# EAGLE schematic USB-PD-PSU (EAGLE 9.2.1)

## Sheet 1 of 3: USB-PD
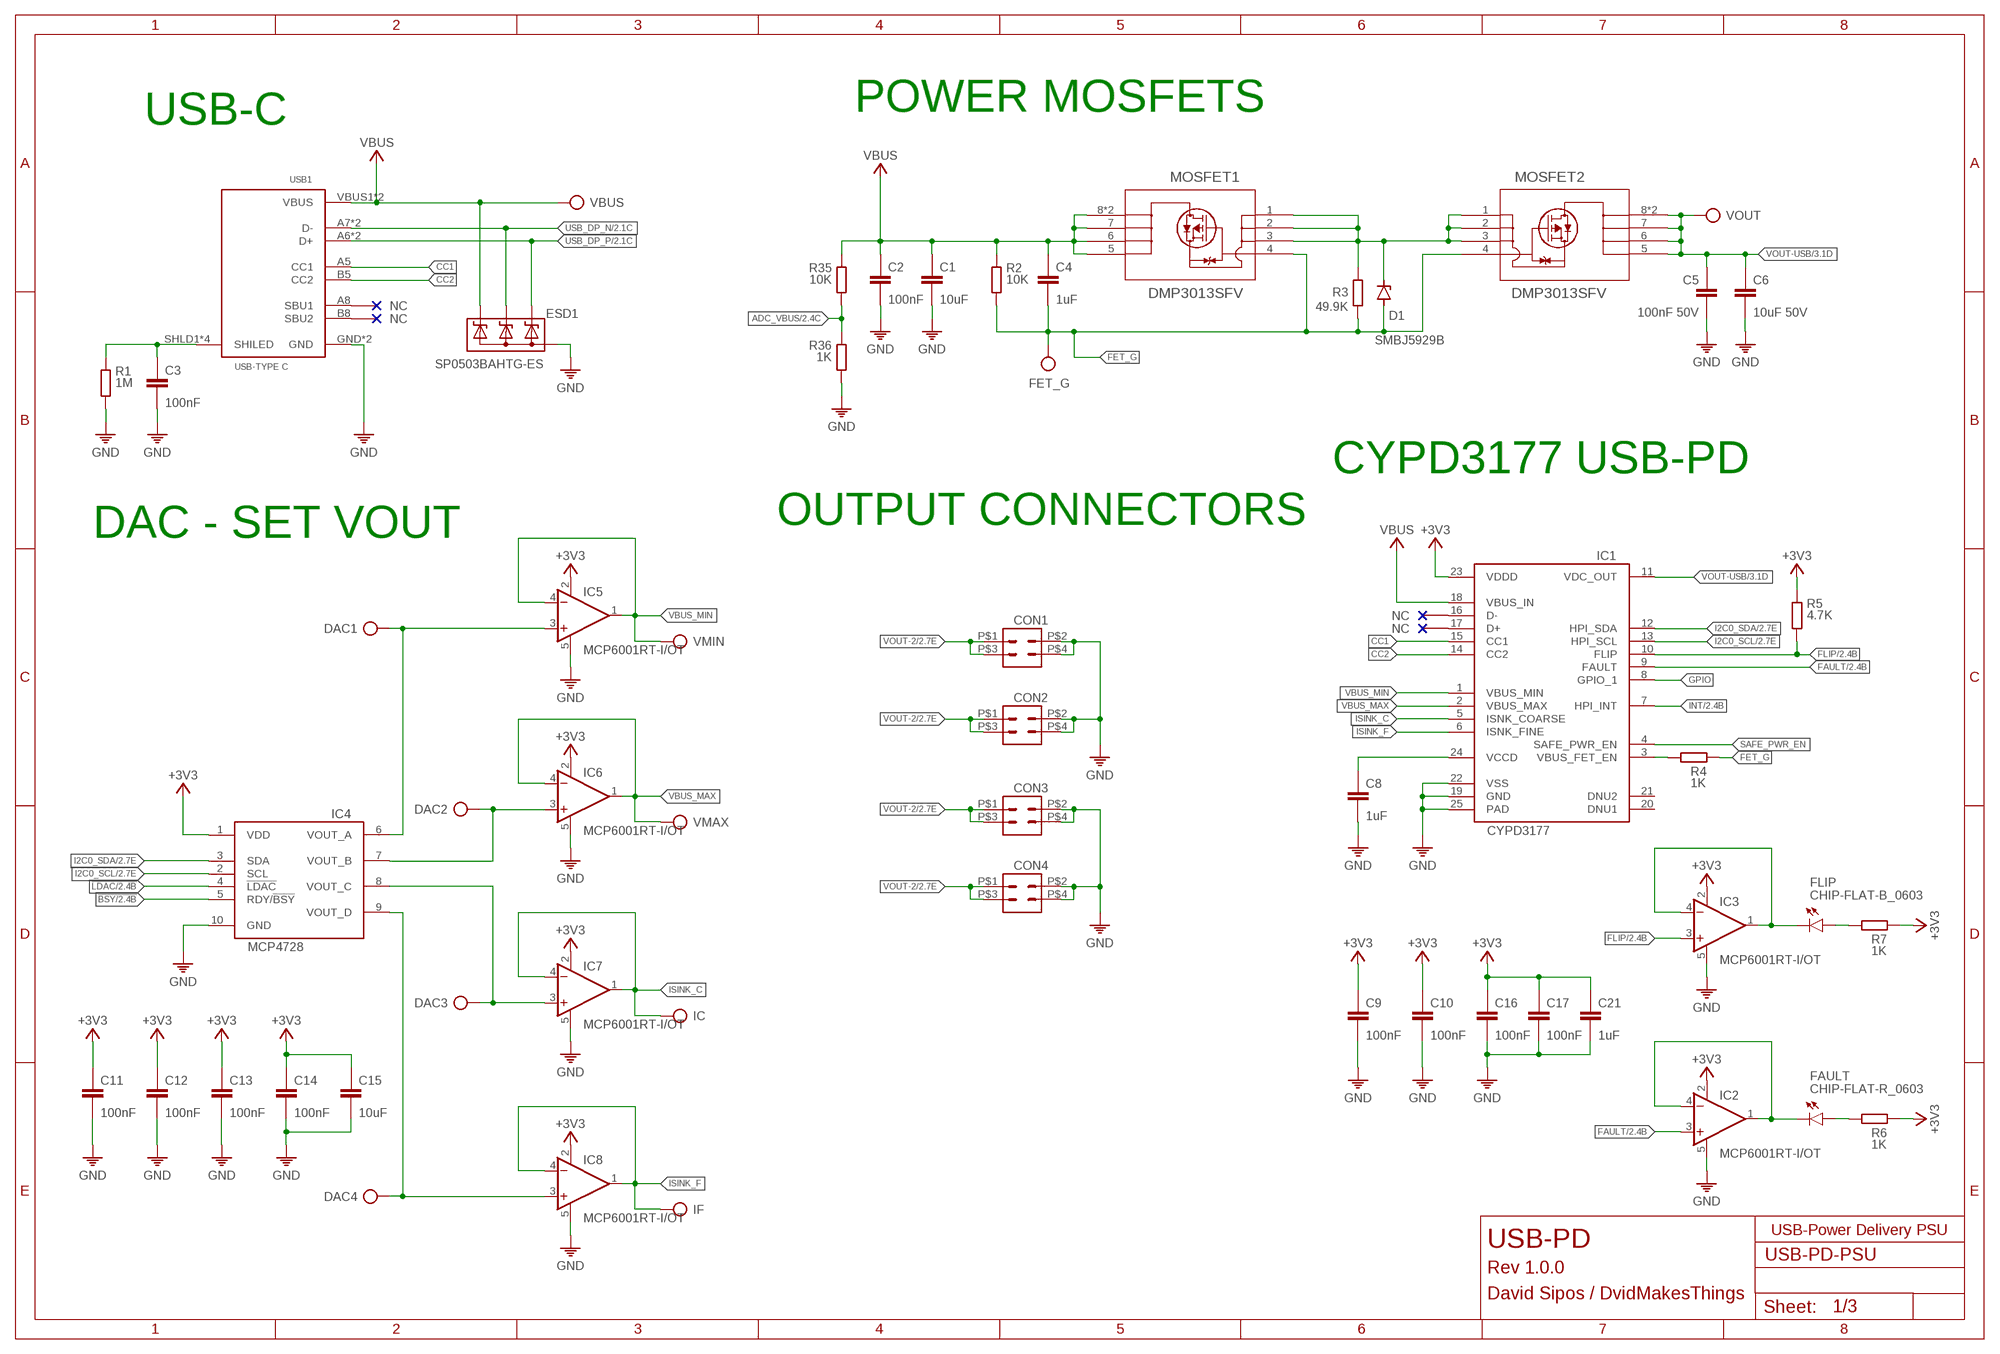
[diagram p0: schematic, sheet 1]

### Parts
C1  10uF  C-0805  [C0805]
C2  100nF  C-0603  [C0603]
C3  100nF  C-0603  [C0603]
C4  1uF  C-0603  [C0603]
C5  100nF 50V  C-0603  [C0603]
C6  10uF 50V  C-0603  [C0603]
C8  1uF  C-0201  [0201]
C9  100nF  C-0201  [0201]
C10  100nF  C-0201  [0201]
C11  100nF  C-0201  [0201]
C12  100nF  C-0201  [0201]
C13  100nF  C-0201  [0201]
C14  100nF  C-0201  [0201]
C15  10uF  C-0201  [0201]
C16  100nF  C-0201  [0201]
C17  100nF  C-0201  [0201]
C21  1uF  C-0201  [0201]
CON1  CON-2X2SMD  [2X2_SMD]
CON2  CON-2X2SMD  [2X2_SMD]
CON3  CON-2X2SMD  [2X2_SMD]
CON4  CON-2X2SMD  [2X2_SMD]
D1  SMBJ5929B  ZENERDO-214AC(SMA)  [DIOM5226X290N]
DAC1  TP  [TP]
DAC2  TP  [TP]
DAC3  TP  [TP]
DAC4  TP  [TP]
ESD1  SP0503BAHTG-ES  SP0503BAHT  [SOT143]
FAULT  CHIP-FLAT-R_0603  CHIP-FLAT-R_0603-0.55MM  [LEDC1608X55N_FLAT-R]
FET_G  TP  [TP]
FLIP  CHIP-FLAT-B_0603  CHIP-FLAT-B_0603-0.55MM  [LEDC1608X55N_FLAT-B]
IC  TP  [TP]
IC1  CYPD3177  CYPD3177-24LQXQT  [QFN24]
IC2  MCP6001RT-I/OT  MCP6001RT  [SOT23-5]
IC3  MCP6001RT-I/OT  MCP6001RT  [SOT23-5]
IC4  MCP4728  [MSOP10]
IC5  MCP6001RT-I/OT  MCP6001RT  [SOT23-5]
IC6  MCP6001RT-I/OT  MCP6001RT  [SOT23-5]
IC7  MCP6001RT-I/OT  MCP6001RT  [SOT23-5]
IC8  MCP6001RT-I/OT  MCP6001RT  [SOT23-5]
IF  TP  [TP]
MOSFET1  DMP3013SFV  DMP3013SFV-7POWERDI3333-8_UX_DIO  [POWERDI3333-8_UX_DIO-L]
MOSFET2  DMP3013SFV  DMP3013SFV-7POWERDI3333-8_UX_DIO  [POWERDI3333-8_UX_DIO-L]
R1  1M  R0402  [0402]
R2  10K  R0402  [0402]
R3  49.9K  R0402  [0402]
R4  1K  R0201  [R0201]
R5  4.7K  R0201  [R0201]
R6  1K  R0201  [R0201]
R7  1K  R0201  [R0201]
R35  10K  R0402  [0402]
R36  1K  R0402  [0402]
USB1  USB_C-THT  [USB-C]
VBUS  TP  [TP]
VMAX  TP  [TP]
VMIN  TP  [TP]
VOUT  TP  [TP]

### Nets
!BSY: IC4.5(RDY/!BSY) ; also sheet 2
!LDAC: IC4.4(!LDAC) ; also sheet 2
+3V3: C9.1 C10.1 C11.1 C12.1 C13.1 C14.1 C15.1 C16.1 C17.1 C21.1 IC1.23(VDDD) IC2.2(V+) IC3.2(V+) IC4.1(VDD) IC5.2(V+) IC6.2(V+) IC7.2(V+) IC8.2(V+) R5.1 R6.1 R7.1 ; also sheet 2,3
ADC_VBUS: R35.2 R36.1 ; also sheet 2
CC1: IC1.15(CC1) USB1.A5(CC1)
CC2: IC1.14(CC2) USB1.B5(CC2)
FAULT: IC1.9(FAULT) IC2.3(+IN) ; also sheet 2
FET_G: C4.2 D1.2(A) FET_G.TP MOSFET1.4(G) MOSFET2.4(G) R2.2 R3.2 R4.1
FLIP: IC1.10(FLIP) IC3.3(+IN) R5.2 ; also sheet 2
GND: C1.2 C2.2 C3.2 C5.2 C6.2 C8.2 C9.2 C10.2 C11.2 C12.2 C13.2 C14.2 C15.2 C16.2 C17.2 C21.2 CON1.P$2 CON1.P$4 CON2.P$2 CON2.P$4 CON3.P$2 CON3.P$4 CON4.P$2 CON4.P$4 ESD1.1(A) IC1.19(GND) IC1.22(VSS) IC1.25(PAD) IC2.5(V-) IC3.5(V-) IC4.10(GND) IC5.5(V-) IC6.5(V-) IC7.5(V-) IC8.5(V-) R1.2 R36.2 USB1.GND USB1.GND2(GND) ; also sheet 2,3
GPIO: IC1.8(GPIO_1)
I2C0_SCL: IC1.13(HPI_SCL) IC4.2(SCL) ; also sheet 2
I2C0_SDA: IC1.12(HPI_SDA) IC4.3(SDA) ; also sheet 2
INT: IC1.7(HPI_INT) ; also sheet 2
ISINK_C: IC1.5(ISNK_COARSE) IC7.1(OUT) IC7.4(-IN) IC.TP
ISINK_F: IC1.6(ISNK_FINE) IC8.1(OUT) IC8.4(-IN) IF.TP
N$1: C3.1 R1.1 USB1.SHLD1(SHILED) USB1.SHLD2(SHILED) USB1.SHLD3(SHILED) USB1.SHLD4(SHILED)
N$2: FLIP.C IC3.1(OUT) IC3.4(-IN)
N$3: C8.1 IC1.24(VCCD)
N$4: IC1.3(VBUS_FET_EN) R4.2
N$5: D1.1(C) MOSFET1.1(S_2) MOSFET1.2(S_3) MOSFET1.3(S) MOSFET2.1(S_2) MOSFET2.2(S_3) MOSFET2.3(S) R3.1
N$6: FAULT.C IC2.1(OUT) IC2.4(-IN)
N$7: FLIP.A R7.2
N$8: FAULT.A R6.2
N$13: DAC1.TP IC4.6(VOUT_A) IC5.3(+IN)
N$14: DAC2.TP IC4.7(VOUT_B) IC6.3(+IN)
N$15: DAC3.TP IC4.8(VOUT_C) IC7.3(+IN)
N$16: DAC4.TP IC4.9(VOUT_D) IC8.3(+IN)
SAFE_PWR_EN: IC1.4(SAFE_PWR_EN)
USB_DP_N [90R_DIFFPAIR]: ESD1.3(C2) USB1.A7(D-) USB1.B7(D-) ; also sheet 2
USB_DP_P [90R_DIFFPAIR]: ESD1.2(C1) USB1.A6(D+) USB1.B6(D+) ; also sheet 2
VBUS: C1.1 C2.1 C4.1 ESD1.4(C3) IC1.18(VBUS_IN) MOSFET1.5(D_2) MOSFET1.6(D_3) MOSFET1.7(D_4) MOSFET1.8(D) MOSFET1.9(D) R2.1 R35.1 USB1.VBUS1(VBUS) USB1.VBUS2(VBUS) VBUS.TP ; also sheet 2,3
VBUS_MAX: IC1.2(VBUS_MAX) IC6.1(OUT) IC6.4(-IN) VMAX.TP
VBUS_MIN: IC1.1(VBUS_MIN) IC5.1(OUT) IC5.4(-IN) VMIN.TP
VOUT-2: CON1.P$1 CON1.P$3 CON2.P$1 CON2.P$3 CON3.P$1 CON3.P$3 CON4.P$1 CON4.P$3 ; also sheet 2,3
VOUT-USB: C5.1 C6.1 IC1.11(VDC_OUT) MOSFET2.5(D_2) MOSFET2.6(D_3) MOSFET2.7(D_4) MOSFET2.8(D) MOSFET2.9(D) VOUT.TP ; also sheet 3
Unconnected: IC1.16(D-) IC1.17(D+) IC1.20(DNU1) IC1.21(DNU2) USB1.A8(SBU1) USB1.B8(SBU2)

### Notes on the sheet
- USB-C | POWER MOSFETS
- CYPD3177 USB-PD
- DAC - SET VOUT | OUTPUT CONNECTORS
- USB-Power Delivery PSU
- USB-PD
- Rev 1.0.0
- David Sipos / DvidMakesThings

## Sheet 2 of 3: MCU
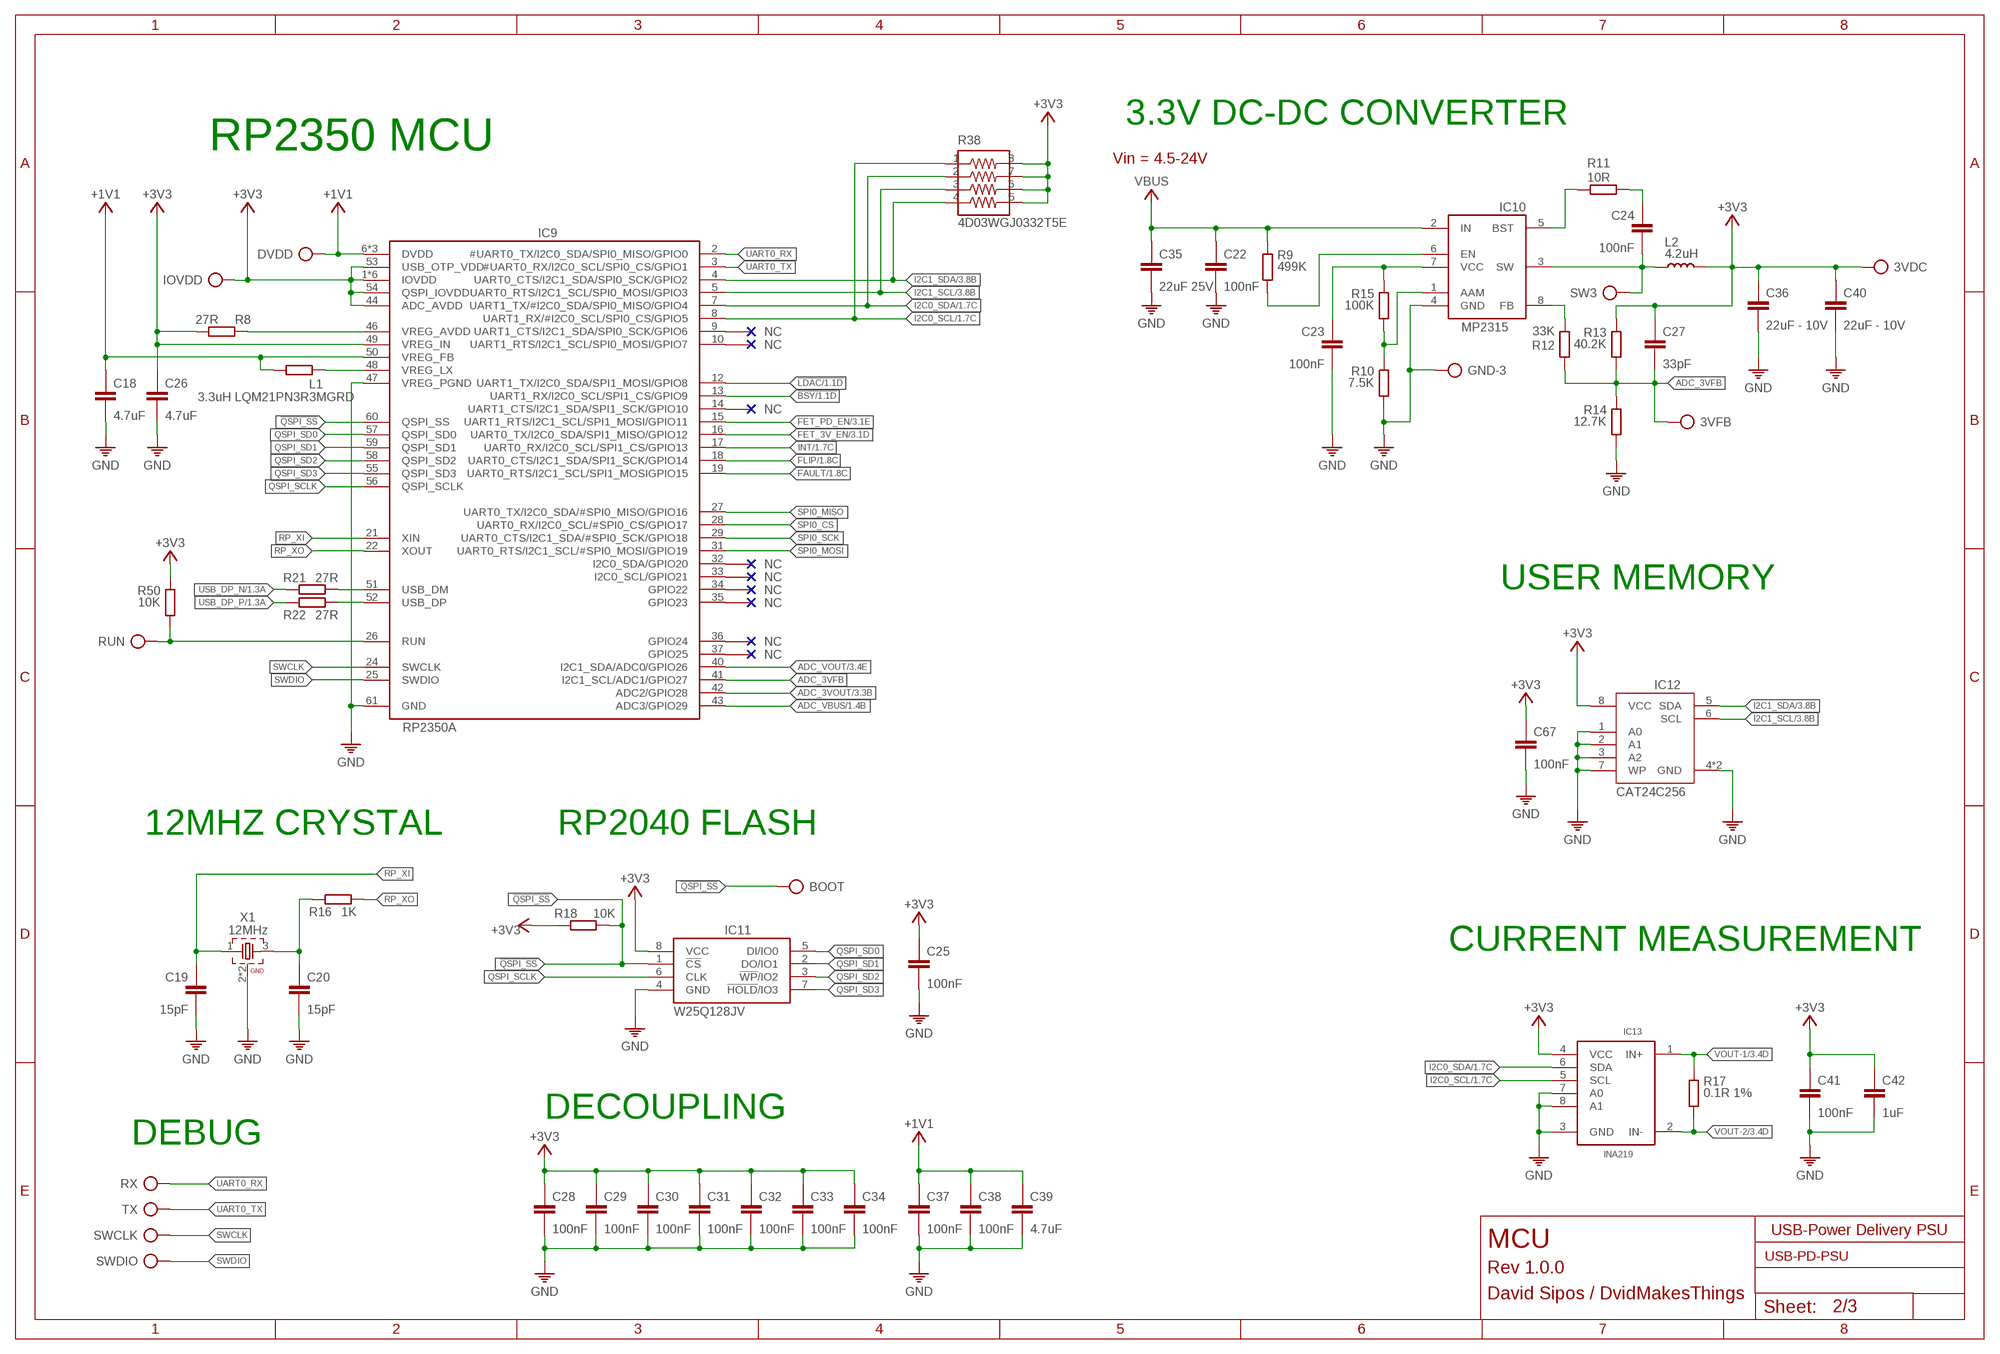
[diagram p1: schematic, sheet 2]

### Parts
3VDC  TP  [TP]
3VFB  TP  [TP]
BOOT  TP  [TP]
C18  4.7uF  C-0201  [0201]
C19  15pF  C-0402  [C0402]
C20  15pF  C-0402  [C0402]
C22  100nF  C0402  [0402]
C23  100nF  C0402  [0402]
C24  100nF  C0402  [0402]
C25  100nF  C-0402  [C0402]
C26  4.7uF  C-0201  [0201]
C27  33pF  C0402  [0402]
C28  100nF  C-0201  [0201]
C29  100nF  C-0201  [0201]
C30  100nF  C-0201  [0201]
C31  100nF  C-0201  [0201]
C32  100nF  C-0201  [0201]
C33  100nF  C-0201  [0201]
C34  100nF  C-0201  [0201]
C35  22uF 25V  C-1206  [C1206]
C36  22uF - 10V  C-1206  [C1206]
C37  100nF  C-0201  [0201]
C38  100nF  C-0201  [0201]
C39  4.7uF  C-0201  [0201]
C40  22uF - 10V  C-1206  [C1206]
C41  100nF  C-0201  [0201]
C42  1uF  C-0201  [0201]
C67  100nF  C-0201  [0201]
DVDD  TP  [TP]
GND-3  TP  [TP]
IC9  RP2350AA  [QFN40P700X700X85-61T340N]
IC10  MP2315S  MP2315TSOT23-8  [SOT65P280X110-8N]
IC11  W25Q128JVPIQ  W25Q128JVP  [SON127P600X500X75-8N]
IC12  CAT24C512HU5IGT3  CAT24C256-HU4  [SON50P300X200X50-9T130X140N]
IC13  INA219BIDCNT  [SOT23-8]
IOVDD  TP  [TP]
L1  3.3uH LQM21PN3R3MGRD  R0805  [0805]
L2  4.2uH  L  [SRR5228A]
R8  27R  R0201  [R0201]
R9  499K  R0402  [0402]
R10  7.5K  R0402  [0402]
R11  10R  R0402  [0402]
R12  33K  R0402  [0402]
R13  40.2K  R0402  [0402]
R14  12.7K  R0402  [0402]
R15  100K  R0402  [0402]
R16  1K  R0201  [R0201]
R17  0.1R 1%  R2512  [2512]
R18  10K  R0402  [0402]
R21  27R  R0201  [R0201]
R22  27R  R0201  [R0201]
R38  4D03WGJ0332T5E  742C083103JP  [742C083103JP]
R50  10K  R0402  [0402]
RUN  TP  [TP]
RX  TP  [TP]
SW3  TP  [TP]
SWCLK  TP  [TP]
SWDIO  TP  [TP]
TX  TP  [TP]
X1  12MHz  WE-XTAL_CFPX-180_830055295  [WE-XTAL_CFPX-180]

### Nets
!BSY: IC9.13(UART1_RX/I2C0_SCL/SPI1_CS/GPIO9) ; also sheet 1
!LDAC: IC9.12(UART1_TX/I2C0_SDA/SPI1_MOSI/GPIO8) ; also sheet 1
!QSPI_SS: BOOT.TP IC9.60(QSPI_SS) IC11.1(!CS) R18.1
+1V1: C18.1 C37.1 C38.1 C39.1 DVDD.TP IC9.6(DVDD) IC9.23(DVDD) IC9.39(DVDD) IC9.50(VREG_FB) L1.2
+3V3: 3VDC.TP C25.1 C26.1 C27.1 C28.1 C29.1 C30.1 C31.1 C32.1 C33.1 C34.1 C36.1 C40.1 C41.1 C42.1 C67.1 IC9.1(IOVDD) IC9.11(IOVDD) IC9.20(IOVDD) IC9.30(IOVDD) IC9.38(IOVDD) IC9.44(ADC_AVDD) IC9.45(IOVDD) IC9.49(VREG_IN) IC9.53(USB_OTP_VDD) IC9.54(QSPI_IOVDD) IC11.8(VCC) IC12.8(VCC) IC13.4(VCC) IOVDD.TP L2.2 R8.2 R13.1 R18.2 R38.5 R38.6 R38.7 R38.8 R50.1 ; also sheet 1,3
ADC_3VFB: 3VFB.TP C27.2 IC9.41(I2C1_SCL/ADC1/GPIO27) R12.2 R13.2 R14.1
ADC_3VOUT: IC9.42(ADC2/GPIO28) ; also sheet 3
ADC_VBUS: IC9.43(ADC3/GPIO29) ; also sheet 1
ADC_VOUT: IC9.40(I2C1_SDA/ADC0/GPIO26) ; also sheet 3
FAULT: IC9.19(UART0_RTS/I2C1_SCL/SPI1_MOSIGPIO15) ; also sheet 1
FET_3V_EN: IC9.16(UART0_TX/I2C0_SDA/SPI1_MISO/GPIO12) ; also sheet 3
FET_PD_EN: IC9.15(UART1_RTS/I2C1_SCL/SPI1_MOSI/GPIO11) ; also sheet 3
FLIP: IC9.18(UART0_CTS/I2C1_SDA/SPI1_SCK/GPIO14) ; also sheet 1
GND: C18.2 C19.2 C20.2 C22.2 C23.2 C25.2 C26.2 C28.2 C29.2 C30.2 C31.2 C32.2 C33.2 C34.2 C35.2 C36.2 C37.2 C38.2 C39.2 C40.2 C41.2 C42.2 C67.2 GND-3.TP IC9.47(VREG_PGND) IC9.61(GND) IC10.4(GND) IC11.4(GND) IC12.1(A0) IC12.2(A1) IC12.3(A2) IC12.4(GND) IC12.7(WP) IC12.9(GND) IC13.3(GND) IC13.7(A0) IC13.8(A1) R10.2 R14.2 X1.2(GND) X1.4(GND) ; also sheet 1,3
I2C0_SCL: IC9.8(UART1_RX/#I2C0_SCL/SPI0_CS/GPIO5) IC13.5(SCL) R38.1 ; also sheet 1
I2C0_SDA: IC9.7(UART1_TX/#I2C0_SDA/SPI0_MISO/GPIO4) IC13.6(SDA) R38.2 ; also sheet 1
I2C1_SCL: IC9.5(UART0_RTS/I2C1_SCL/SPI0_MOSI/GPIO3) IC12.6(SCL) R38.3 ; also sheet 3
I2C1_SDA: IC9.4(UART0_CTS/I2C1_SDA/SPI0_SCK/GPIO2) IC12.5(SDA) R38.4 ; also sheet 3
INT: IC9.17(UART0_RX/I2C0_SCL/SPI1_CS/GPIO13) ; also sheet 1
MCU_DP_N [90R_DIFFPAIR]: IC9.51(USB_DM) R21.2
MCU_DP_P [90R_DIFFPAIR]: IC9.52(USB_DP) R22.2
N$9: C20.1 R16.1 X1.3
N$10: IC9.46(VREG_AVDD) R8.1
N$11: IC9.48(VREG_LX) L1.1
N$17: IC9.26(RUN) R50.2 RUN.TP
N$38: IC10.5(BST) R11.2
N$39: IC10.8(FB) R12.1
N$41: C24.1 R11.1
N$43: IC10.6(EN) R9.2
N$44: C23.1 IC10.7(VCC) R15.1
N$46: IC10.1(AAM) R10.1 R15.2
QSPI_SCLK: IC9.56(QSPI_SCLK) IC11.6(CLK)
QSPI_SD0: IC9.57(QSPI_SD0) IC11.5(DI/IO0)
QSPI_SD1: IC9.59(QSPI_SD1) IC11.2(DO/IO1)
QSPI_SD2: IC9.58(QSPI_SD2) IC11.3(!WP!/IO2)
QSPI_SD3: IC9.55(QSPI_SD3) IC11.7(!HOLD!/IO3)
RP_XI: C19.1 IC9.21(XIN) X1.1
RP_XO: IC9.22(XOUT) R16.2
SPI0_CS: IC9.28(UART0_RX/I2C0_SCL/#SPI0_CS/GPIO17)
SPI0_MISO: IC9.27(UART0_TX/I2C0_SDA/#SPI0_MISO/GPIO16)
SPI0_MOSI: IC9.31(UART0_RTS/I2C1_SCL/#SPI0_MOSI/GPIO19)
SPI0_SCK: IC9.29(UART0_CTS/I2C1_SDA/#SPI0_SCK/GPIO18)
SW3: C24.2 IC10.3(SW) L2.1 SW3.TP
SWCLK: IC9.24(SWCLK) SWCLK.TP
SWDIO: IC9.25(SWDIO) SWDIO.TP
UART0_RX: IC9.2(#UART0_TX/I2C0_SDA/SPI0_MISO/GPIO0) RX.TP
UART0_TX: IC9.3(#UART0_RX/I2C0_SCL/SPI0_CS/GPIO1) TX.TP
USB_DP_N [90R_DIFFPAIR]: R21.1 ; also sheet 1
USB_DP_P [90R_DIFFPAIR]: R22.1 ; also sheet 1
VBUS: C22.1 C35.1 IC10.2(IN) R9.1 ; also sheet 1,3
VOUT-1: IC13.1(IN+) R17.1 ; also sheet 3
VOUT-2: IC13.2(IN-) R17.2 ; also sheet 1,3
Unconnected: IC9.9(UART1_CTS/I2C1_SDA/SPI0_SCK/GPIO6) IC9.10(UART1_RTS/I2C1_SCL/SPI0_MOSI/GPIO7) IC9.14(UART1_CTS/I2C1_SDA/SPI1_SCK/GPIO10) IC9.32(I2C0_SDA/GPIO20) IC9.33(I2C0_SCL/GPIO21) IC9.34(GPIO22) IC9.35(GPIO23) IC9.36(GPIO24) IC9.37(GPIO25)

### Notes on the sheet
- 3.3V DC-DC CONVERTER
- RP2350 MCU
- Vin = 4.5-24V
- USER MEMORY
- 12MHZ CRYSTAL | RP2040 FLASH
- CURRENT MEASUREMENT
- DECOUPLING
- DEBUG
- USB-Power Delivery PSU
- MCU
- Rev 1.0.0
- David Sipos / DvidMakesThings

## Sheet 3 of 3: PSU Control
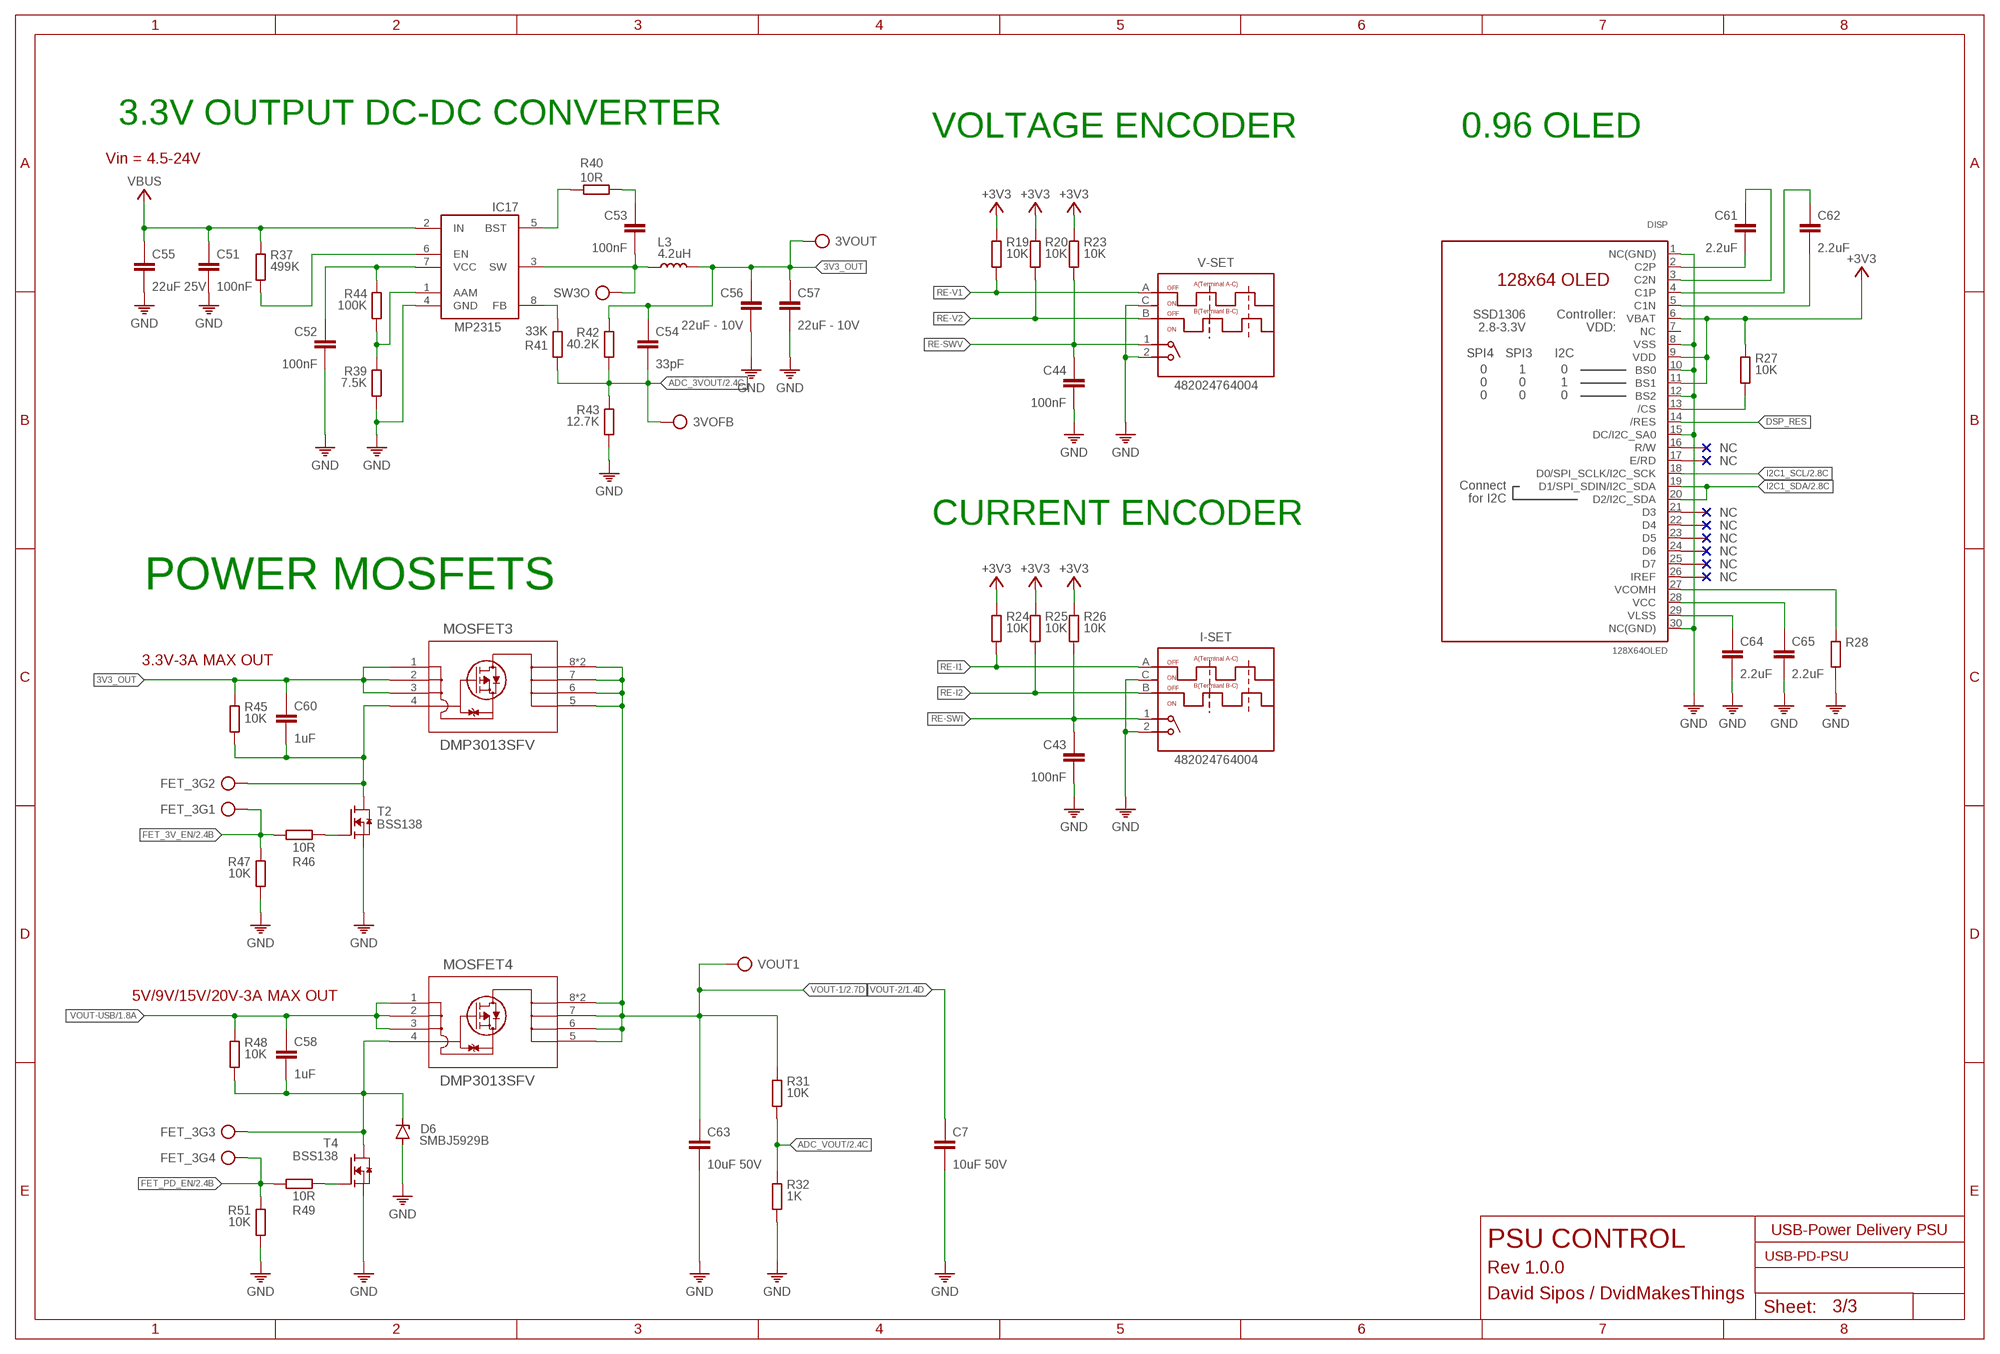
[diagram p2: schematic, sheet 3]

### Parts
3VOFB  TP  [TP]
3VOUT  TP  [TP]
C7  10uF 50V  C-0805  [C0805]
C43  100nF  C-0201  [0201]
C44  100nF  C-0201  [0201]
C51  100nF  C0402  [0402]
C52  100nF  C0402  [0402]
C53  100nF  C0402  [0402]
C54  33pF  C0402  [0402]
C55  22uF 25V  C-1206  [C1206]
C56  22uF - 10V  C-1206  [C1206]
C57  22uF - 10V  C-1206  [C1206]
C58  1uF  C-0603  [C0603]
C60  1uF  C-0603  [C0603]
C61  2.2uF  C-0201  [0201]
C62  2.2uF  C-0201  [0201]
C63  10uF 50V  C-0603  [C0603]
C64  2.2uF  C-0201  [0201]
C65  2.2uF  C-0201  [0201]
D6  SMBJ5929B  ZENERDO-214AC(SMA)  [DIOM5226X290N]
DISP  128X64OLED  [UG2864]
FET_3G1  TP  [TP]
FET_3G2  TP  [TP]
FET_3G3  TP  [TP]
FET_3G4  TP  [TP]
I-SET  482024764004  [WS-ENTV_482024764004]
IC17  MP2315S  MP2315TSOT23-8  [SOT65P280X110-8N]
L3  4.2uH  L  [SRR5228A]
MOSFET3  DMP3013SFV  DMP3013SFV-7POWERDI3333-8_UX_DIO  [POWERDI3333-8_UX_DIO-L]
MOSFET4  DMP3013SFV  DMP3013SFV-7POWERDI3333-8_UX_DIO  [POWERDI3333-8_UX_DIO-L]
R19  10K  R0201  [R0201]
R20  10K  R0201  [R0201]
R23  10K  R0201  [R0201]
R24  10K  R0201  [R0201]
R25  10K  R0201  [R0201]
R26  10K  R0201  [R0201]
R27  10K  R0201  [R0201]
R28  R0201  [R0201]
R31  10K  R0402  [0402]
R32  1K  R0402  [0402]
R37  499K  R0402  [0402]
R39  7.5K  R0402  [0402]
R40  10R  R0402  [0402]
R41  33K  R0402  [0402]
R42  40.2K  R0402  [0402]
R43  12.7K  R0402  [0402]
R44  100K  R0402  [0402]
R45  10K  R0402  [0402]
R46  10R  R0402  [0402]
R47  10K  R0402  [0402]
R48  10K  R0402  [0402]
R49  10R  R0402  [0402]
R51  10K  R0402  [0402]
SW3O  TP  [TP]
T2  BSS138  [SOT23]
T4  BSS138  [SOT23]
V-SET  482024764004  [WS-ENTV_482024764004]
VOUT1  TP  [TP]

### Nets
3V3_OUT: 3VOUT.TP C54.1 C56.1 C57.1 C60.1 L3.2 MOSFET3.1(S_2) MOSFET3.2(S_3) MOSFET3.3(S) R42.1 R45.1
+3V3: DISP.6(VBAT) DISP.9(VDD) DISP.11(BS1) R19.1 R20.1 R23.1 R24.1 R25.1 R26.1 R27.1 ; also sheet 1,2
ADC_3VOUT: 3VOFB.TP C54.2 R41.2 R42.2 R43.1 ; also sheet 2
ADC_VOUT: R31.2 R32.1 ; also sheet 2
DSP_RES: DISP.14(/RES)
FET_3V_EN: FET_3G1.TP R46.1 R47.1 ; also sheet 2
FET_G1: C60.2 FET_3G2.TP MOSFET3.4(G) R45.2 T2.3(D)
FET_G2: C58.2 D6.1(C) FET_3G3.TP MOSFET4.4(G) R48.2 T4.3(D)
FET_PD_EN: FET_3G4.TP R49.1 R51.1 ; also sheet 2
GND: C7.2 C43.2 C44.2 C51.2 C52.2 C55.2 C56.2 C57.2 C63.2 C64.2 C65.2 D6.2(A) DISP.1(NC(GND)) DISP.8(VSS) DISP.10(BS0) DISP.12(BS2) DISP.15(DC/I2C_SA0) DISP.30(NC(GND)) I-SET.2 I-SET.C(COM) IC17.4(GND) R28.2 R32.2 R39.2 R43.2 R47.2 R51.2 T2.2(S) T4.2(S) V-SET.2 V-SET.C(COM) ; also sheet 1,2
I2C1_SCL: DISP.18(D0/SPI_SCLK/I2C_SCK) ; also sheet 2
I2C1_SDA: DISP.19(D1/SPI_SDIN/I2C_SDA) DISP.20(D2/I2C_SDA) ; also sheet 2
N$12: C61.2 DISP.2(C2P)
N$18: C61.1 DISP.3(C2N)
N$19: C62.1 DISP.4(C1P)
N$20: C62.2 DISP.5(C1N)
N$23: DISP.13(/CS) R27.2
N$24: IC17.5(BST) R40.2
N$25: IC17.8(FB) R41.1
N$26: C53.1 R40.1
N$27: IC17.6(EN) R37.2
N$28: C52.1 IC17.7(VCC) R44.1
N$29: IC17.1(AAM) R39.1 R44.2
N$33: R46.2 T2.1(G)
N$34: DISP.27(VCOMH) R28.1
N$35: C65.1 DISP.28(VCC)
N$36: R49.2 T4.1(G)
N$37: C64.1 DISP.29(VLSS)
RE-I1: I-SET.A R24.2
RE-I2: I-SET.B R25.2
RE-SWI: C43.1 I-SET.1 R26.2
RE-SWV: C44.1 R23.2 V-SET.1
RE-V1: R19.2 V-SET.A
RE-V2: R20.2 V-SET.B
SW1: C53.2 IC17.3(SW) L3.1 SW3O.TP
VBUS: C51.1 C55.1 IC17.2(IN) R37.1 ; also sheet 1,2
VOUT-1: C63.1 MOSFET3.5(D_2) MOSFET3.6(D_3) MOSFET3.7(D_4) MOSFET3.8(D) MOSFET3.9(D) MOSFET4.5(D_2) MOSFET4.6(D_3) MOSFET4.7(D_4) MOSFET4.8(D) MOSFET4.9(D) R31.1 VOUT1.TP ; also sheet 2
VOUT-2: C7.1 ; also sheet 1,2
VOUT-USB: C58.1 MOSFET4.1(S_2) MOSFET4.2(S_3) MOSFET4.3(S) R48.1 ; also sheet 1
Unconnected: DISP.7(NC) DISP.16(R/W) DISP.17(E/RD) DISP.21(D3) DISP.22(D4) DISP.23(D5) DISP.24(D6) DISP.25(D7) DISP.26(IREF)

### Notes on the sheet
- 3.3V OUTPUT DC-DC CONVERTER
- VOLTAGE ENCODER | 0.96 OLED
- Vin = 4.5-24V
- CURRENT ENCODER
- POWER MOSFETS
- 3.3V-3A MAX OUT
- 5V/9V/15V/20V-3A MAX OUT
- USB-Power Delivery PSU
- PSU CONTROL
- Rev 1.0.0
- David Sipos / DvidMakesThings

## Library data of the parts
3VDC 3VFB 3VOFB 3VOUT BOOT DAC1-DAC4 DVDD FET_3G1-FET_3G4 FET_G GND-3 IC IF IOVDD RUN RX SW3 SW3O SWCLK SWDIO TX VBUS VMAX VMIN VOUT VOUT1 = ds_passive:TP
C1-C44 C51-C58 C60-C65 C67 = ds_passive:C
CON1-CON4 = ds_con:CON-2X2
D1 D6 = Diode:ZENER: Zener Diode - Generic; CATEGORY: Diode; DESCRIPTION: Zener Diode - Generic Surface Mount DO-214AC(SMA); PACKAGE_SIZE: SMA; PACKAGE_TYPE: SMD; SUBCATEGORY: Zener Diodes
DISP = ds_displays:128X64OLED: 128x64 OLED
ESD1 = ds_ic_peripherals:SP0503BAHT: TVS Diode Arrays Surface Mount TVS Avalanche Diode Array
FAULT = LED:CHIP-FLAT-R: Red LED - Generic; CATEGORY: LED; COLOR: Red; DESCRIPTION: Red LED Indication 0603 (1608 Metric); PACKAGE_SIZE: 0603; PACKAGE_TYPE: SMD; SUBCATEGORY: Chip LED; TYPE: Square with Flat Top
FLIP = LED:CHIP-FLAT-B: Blue LED - Generic; CATEGORY: LED; COLOR: Blue; DESCRIPTION: Blue LED Indication 0603 (1608 Metric); PACKAGE_SIZE: 0603; PACKAGE_TYPE: SMD; SUBCATEGORY: Chip LED; TYPE: Square with Flat Top
I-SET V-SET = Wurth_Switch_WS-ENTV:482024764004: WS-ENTV Mechanical Incremental Encoder Switch 12.4x13.20mm Plastic Shaft without bushing Material Properties Actuator Material PC Actuator Flammability Rating UL94 HB Actuator Color Black Frame Material PBT Frame Flammability Rating UL94 HB Contact Material Copper Alloy Contact Plating Silver Frame Color Black Terminal Material Copper Alloy Terminal Plating Silver General Information Operating Temperature:-40 up to +85 °C Packaging Information Packaging:Tray Electrical Properties IR 10 mA VR 5 V (DC) Contact Resistance Initial 100 mΩ Contact Resistance After Life Test 300 mΩ RISO 100 MΩ Withstanding Voltage 300 V (AC) Mechanical Properties Electrical Life Encoder 30000 Cycles Electrical Life Switch 20000 Cycles Detent 24 Positions Torque Encoder 20 mN*m Operation Force (Value) 300 g Travel 0.5 mm <https://www.we-online.com/components/media/o343310v209%20Family_WS-ENTV_482024764004.jpg> Details see: www.we-online.com/en/components/products/WS_ENTV_MECHANICAL_INCREMENTAL_ENCODER_SWITCH_12_4_13_2_PLASTIC_SHAFT_WITHOUT_BUSHING <www.we-online.com/catalog/WS_ENTV_MECHANICAL_INCREMENTAL_ENCODER_SWITCH_12_4_13_2_PLASTIC_SHAFT_WITHOUT_BUSHING/?utm_source=eagle_model&utm_medium=description_link&utm_campaign=eisos_eagle> Updated by Ella Wu 2023-05-29 2023 (C) Wurth Elektronik; DATASHEET-URL: https://www.we-online.com/redexpert/spec/482024764004?ae; DETENT: 24 Positions; ELECTRICAL-LIFE-ENCODER: 30000 Cycles; ELECTRICAL-LIFE-SWITCH: 20000 Cycles; PART-NUMBER: 482024764004; RESOLUTION: 24 Pulse/360 degree
IC1 = ds_ic_peripherals:CYPD3177: USB Type-C Port Controller for Power Sinks
IC2 IC3 IC5-IC8 = ds_ic_opa:MCP6001RT: 1 MHz, Low-Power Op Amp
IC4 = ds_ic_peripherals:MCP4728: 12-Bit, Quad Digital-to-Analog Converter with EEPROM Memory
IC9 = ds_ic_mcu:RP2350A: RP2350 is a new family of microcontrollers from Raspberry Pi that offers significant enhancements over RP2040. Key features include: • Dual Cortex-M33 or Hazard3 processors at 150 MHz • 520 kB on-chip SRAM, in 10 independent banks • 8 kB of one-time-programmable storage (OTP) • Up to 16 MB of external QSPI flash/PSRAM via dedicated QSPI bus - Additional 16 MB flash/PSRAM accessible via optional second chip-select • On-chip switched-mode power supply to generate core voltage - Low-quiescent-current LDO mode can be enabled for sleep states • 2× on-chip PLLs for internal or external clock generation • Security features: - Optional boot signing, enforced by on-chip mask ROM, with key fingerprint in OTP - Protected OTP storage for optional boot decryption key - Global bus filtering based on Arm or RISC-V security/privilege levels - Peripherals, GPIOs and DMA channels individually assignable to security domains - Hardware mitigations for fault injection attacks - Hardware SHA-256 accelerator • Peripherals: - 2× UARTs - 2× SPI controllers - 2× I2C controllers - 24× PWM channels - USB 1.1 controller and PHY, with host and device support - 12× PIO state machines - 1× HSTX peripheral
IC10 IC17 = ds_ic_vreg:MP2315: Description The MP2315 is a high frequency synchronous rectified step-down switch mode converter with built in internal power MOSFETs. It offers a very compact solution to achieve 3A continuous output current over a wide input supply range with excellent load and line regulation. The MP2315 has synchronous mode operation for higher efficiency over output current load range. Current mode operation provides fast transient response and eases loop stabilization. Full protection features include OCP and thermal shut down.
IC11 = MCU:W25Q128JV: 3V 128M-BIT SERIAL FLASH MEMORY WITH DUAL/QUAD SPI & QPI & DTR
IC12 = ds_ic_memory:CAT24C256: The CAT24C256 is a EEPROM Serial 256−Kb I2C, internally organized as 32,768 words of 8 bits each. It features a 64−byte page write buffer and supports the Standard (100 kHz), Fast (400 kHz) and Fast−Plus (1 MHz) I2C protocol. Write operations can be inhibited by taking the WP pin High (this protects the entire memory). External address pins make it possible to address up to eight CAT24C256 devices on the same bus. On−Chip ECC (Error Correction Code) makes the device suitable for high reliability applications.
IC13 = ds_ic_peripherals:INA219: 26-V 12-bit I2C output digital power monitor
L1 R1-R28 R31 R32 R35-R37 R39-R51 = ds_passive:R
L2 L3 = ds_passive:L
MOSFET1-MOSFET4 = ds_active:DMP3013SFV-7; COPYRIGHT: Copyright (C) 2025 Ultra Librarian. All rights reserved.; MANUFACTURER_PART_NUMBER: DMP3013SFV-7; MFR_NAME: Diodes Inc
R38 = Resistor Array:742C083103JP: RES ARRAY 4 RES 10K OHM 1206 Manufacturer's datasheet <https://www.ctscorp.com/wp-content/uploads/74x.pdf>; CREATED_BY: PCBLayout.com; DIGIKEY_PN: 742C083103JPTR-ND; MANUFACTURER: CTS Resistor Products; MPN: 742C083103JP; PACKAGE: 1206
T2 T4 = ds_active:BSS138
USB1 = ds_con:USB_C
X1 = Wurth_Quartz Crystals & Oscillators_WE-XTAL:WE-XTAL_CFPX-180: WE-XTAL Quartz Crystal Characteristics SMT and THT models Hermetically sealed Frequencies between 1.8432 MHz and 50 MHz Tolerances down to ±10 ppm available Maximum operating temperatures range: -40 °C to 85 °C Stabilities down to ±10 ppm available Applications Microprocessor Wireless Communication Devices Industrial Devices Wired Communication (e.g. Ethernet and USB) IoT Optical Network Audio and Multimedia Devices Test and Measurement Equipment Navigation and Locators Wearables <https://www.we-online.com/catalog/media/o135919v209%20Family_WE-XTAL_IQXC-42.jpg> Details see: https://www.we-online.com/catalog/en/WE-XTAL Updated by Ella Wu , 2020-11-23 2020 (C) Wurth Elektronik; C-LOAD: 18pF; DATASHEET-URL: https://www.we-online.com/catalog/datasheet/830055295.pdf; MOUNT: SMT; PART-NUMBER: 830055295; STABILITY: 30ppm; TOLERANCE: ±20ppm

## Net classes
0 default: width 0.2 mm, drill 0.15 mm, clearance 0.178 mm
2 90R_DIFFPAIR: width 0.155 mm, drill 0.15 mm, clearance 0.191 mm